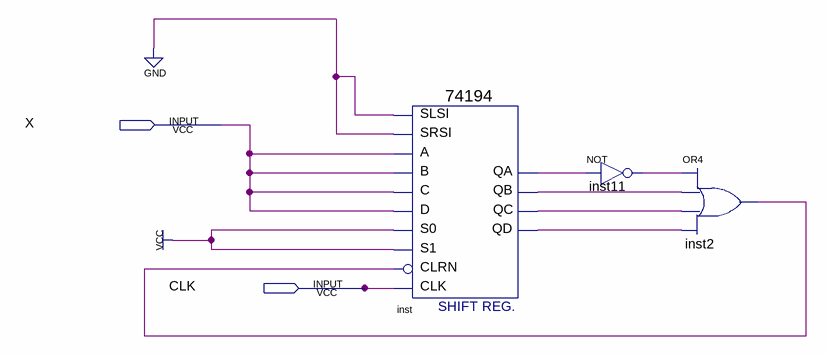
[diagram p0: schematic sheet]
// Quartus schematic COUNT7.bdf as structural Verilog: 3 symbols, 2 pins
module COUNT7 (
  input  X,
  input  CLK
);

  wire inst2_out, inst11_out, inst_qa, inst_qb, inst_qc, inst_qd;

  \74194  inst (
    .SLSI(1'b0), .SRSI(1'b0), .B(X), .C(X), .CLK(CLK), .CLRN(inst2_out), .D(X), .S1(1'b1), .S0(1'b1), .A(X),
    .QA(inst_qa), .QB(inst_qb), .QC(inst_qc), .QD(inst_qd));
  not inst11 (inst11_out, inst_qa);
  or inst2 (inst2_out, inst11_out, inst_qb, inst_qc, inst_qd);
endmodule
